# EAGLE design Video_Controller (EAGLE 9.7.0)
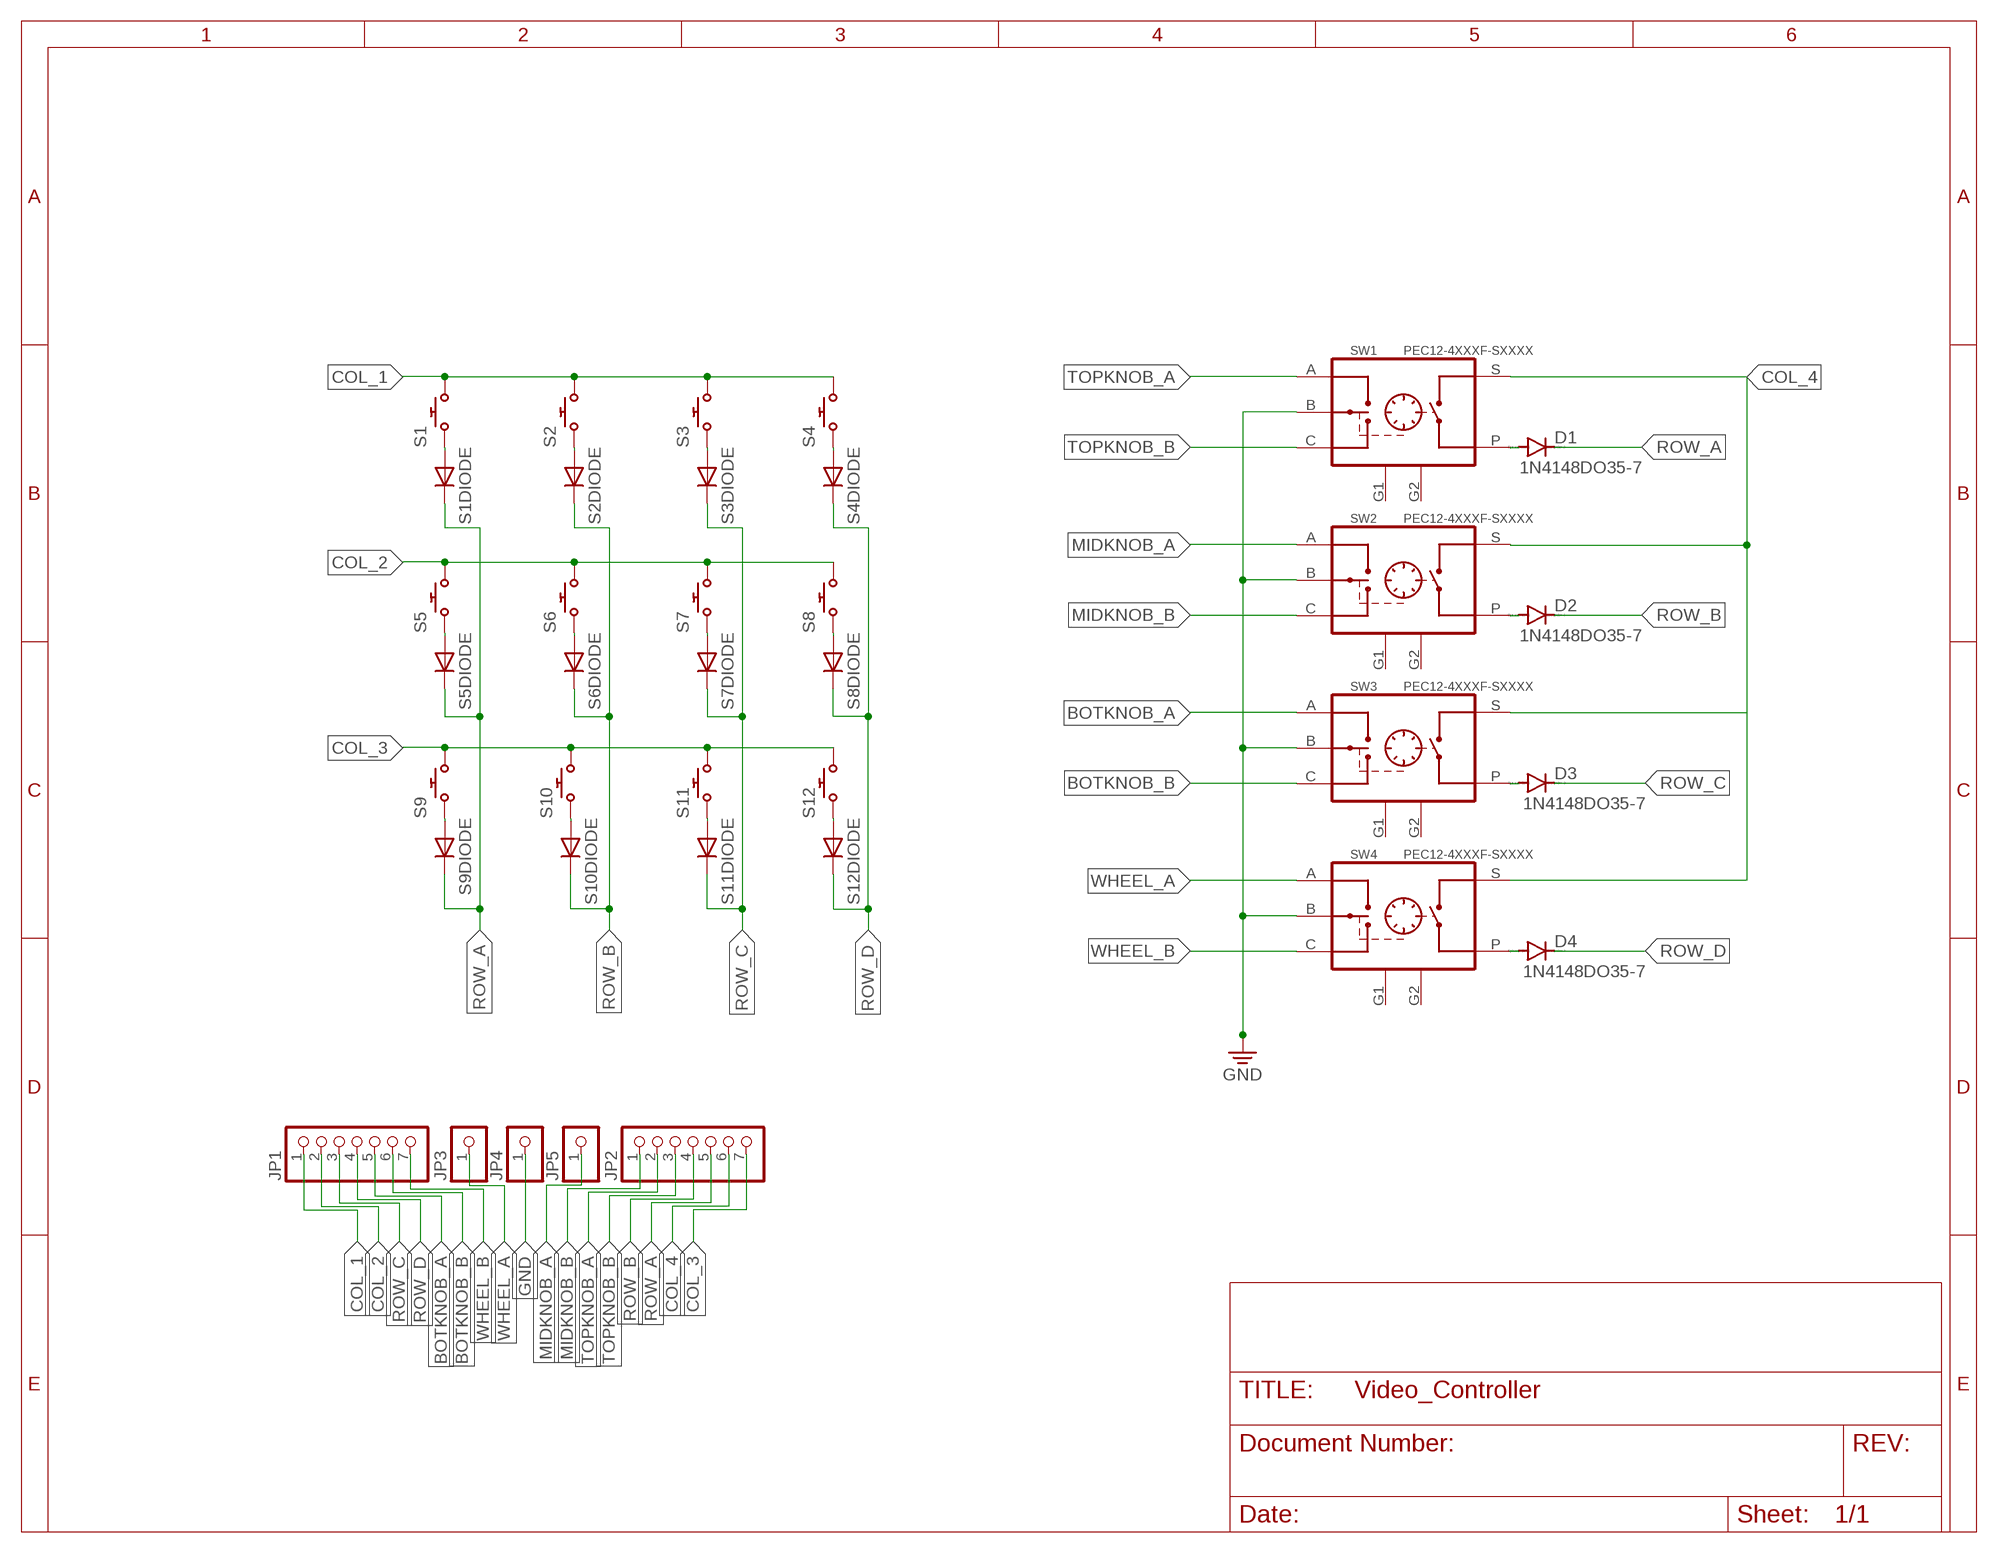
[diagram p0: schematic, sheet 1]

## Parts
D1  1N4148DO35-7  [DO35-7]
D2  1N4148DO35-7  [DO35-7]
D3  1N4148DO35-7  [DO35-7]
D4  1N4148DO35-7  [DO35-7]
JP1  PINHD-1X7  [1X07]
JP2  PINHD-1X7  [1X07]
JP3  PINHD-1X1  [1X01]
JP4  PINHD-1X1  [1X01]
JP5  PINHD-1X1  [1X01]
S1  CHERY_MX_DIODE  [CHERRY_MX_DIODE]
S2  CHERY_MX_DIODE  [CHERRY_MX_DIODE]
S3  CHERY_MX_DIODE  [CHERRY_MX_DIODE]
S4  CHERY_MX_DIODE  [CHERRY_MX_DIODE]
S5  CHERY_MX_DIODE  [CHERRY_MX_DIODE]
S6  CHERY_MX_DIODE  [CHERRY_MX_DIODE]
S7  CHERY_MX_DIODE  [CHERRY_MX_DIODE]
S8  CHERY_MX_DIODE  [CHERRY_MX_DIODE]
S9  CHERY_MX_DIODE  [CHERRY_MX_DIODE]
S10  CHERY_MX_DIODE  [CHERRY_MX_DIODE]
S11  CHERY_MX_DIODE  [CHERRY_MX_DIODE]
S12  CHERY_MX_DIODE  [CHERRY_MX_DIODE]
SW1  PEC12-4XXXF-SXXXX  [PEC12-4XXX]
SW2  PEC12-4XXXF-SXXXX  [PEC12-4XXX]
SW3  PEC12-4XXXF-SXXXX  [PEC12-4XXX]
SW4  PEC12-4XXXF-SXXXX  [PEC12-4XXX]

## Nets
BOTKNOB_A: JP1.5 SW3.A
BOTKNOB_B: JP1.6 SW3.C
COL_1: JP1.1 S1.S2 S2.S2 S3.S2 S4.S2
COL_2: JP1.2 S5.S2 S6.S2 S7.S2 S8.S2
COL_3: JP2.7 S9.S2 S10.S2 S11.S2 S12.S2
COL_4: JP2.6 SW1.S
GND: JP4.1 SW1.B SW2.B SW3.B SW4.B
MIDKNOB_A: JP5.1 SW2.A
MIDKNOB_B: JP2.1 SW2.C
N$1: S1.D1(A) S1.S1
N$2: S2.D1(A) S2.S1
N$3: S3.D1(A) S3.S1
N$4: S4.D1(A) S4.S1
N$5: D1.A SW1.P
N$6: D2.A SW2.P
N$7: D3.A SW3.P
N$8: D4.A SW4.P
N$9: S5.D1(A) S5.S1
N$10: S6.D1(A) S6.S1
N$11: S7.D1(A) S7.S1
N$12: S8.D1(A) S8.S1
N$13: S9.D1(A) S9.S1
N$15: S11.D1(A) S11.S1
N$16: S10.D1(A) S10.S1
N$17: SW2.S SW3.S SW4.S
N$18: S12.D1(A) S12.S1
ROW_A: D1.C JP2.5 S1.D2(C) S5.D2(C) S9.D2(C)
ROW_B: D2.C JP2.4 S2.D2(C) S6.D2(C) S10.D2(C)
ROW_C: D3.C JP1.3 S3.D2(C) S7.D2(C) S11.D2(C)
ROW_D: D4.C JP1.4 S4.D2(C) S8.D2(C) S12.D2(C)
TOPKNOB_A: JP2.2 SW1.A
TOPKNOB_B: JP2.3 SW1.C
WHEEL_A: JP3.1 SW4.A
WHEEL_B: JP1.7 SW4.C
Unconnected: SW1.G1 SW1.G2 SW2.G1 SW2.G2 SW3.G1 SW3.G2 SW4.G1 SW4.G2

## Library data of the parts
D1-D4 = diode:1N4148: DIODE high speed (Philips)
JP1 JP2 = pinhead:PINHD-1X7: PIN HEADER
JP3-JP5 = pinhead:PINHD-1X1: PIN HEADER
S1-S12 = cherry_tow:CHERY_MX_DIODE: Cherry MX with diode; FARNELL: 2292961; MOUSER: 540_MX1A_11NW
SW1-SW4 = buttons:PEC12-4XXXF-SXXXX: Rotary Encoder

## Net classes
0 default: width 0.813 mm, clearance 0.686 mm

## Board
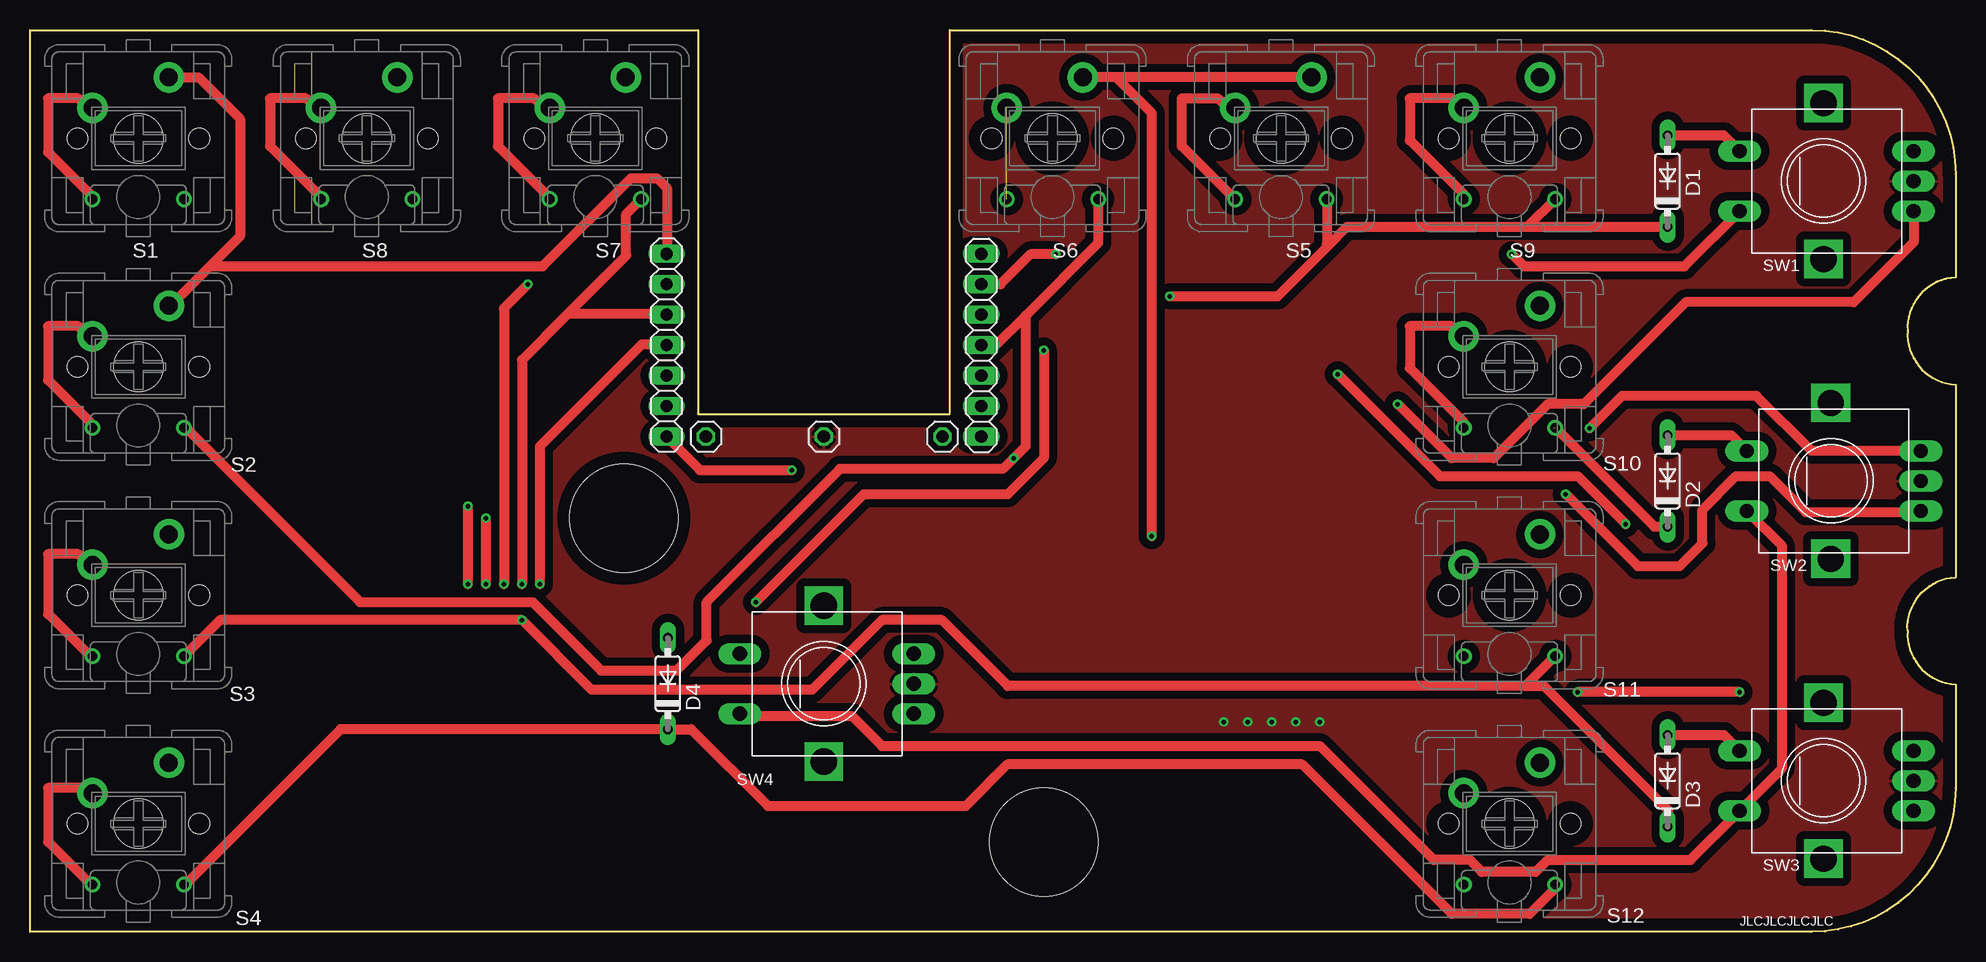
[diagram p1: board, top side]
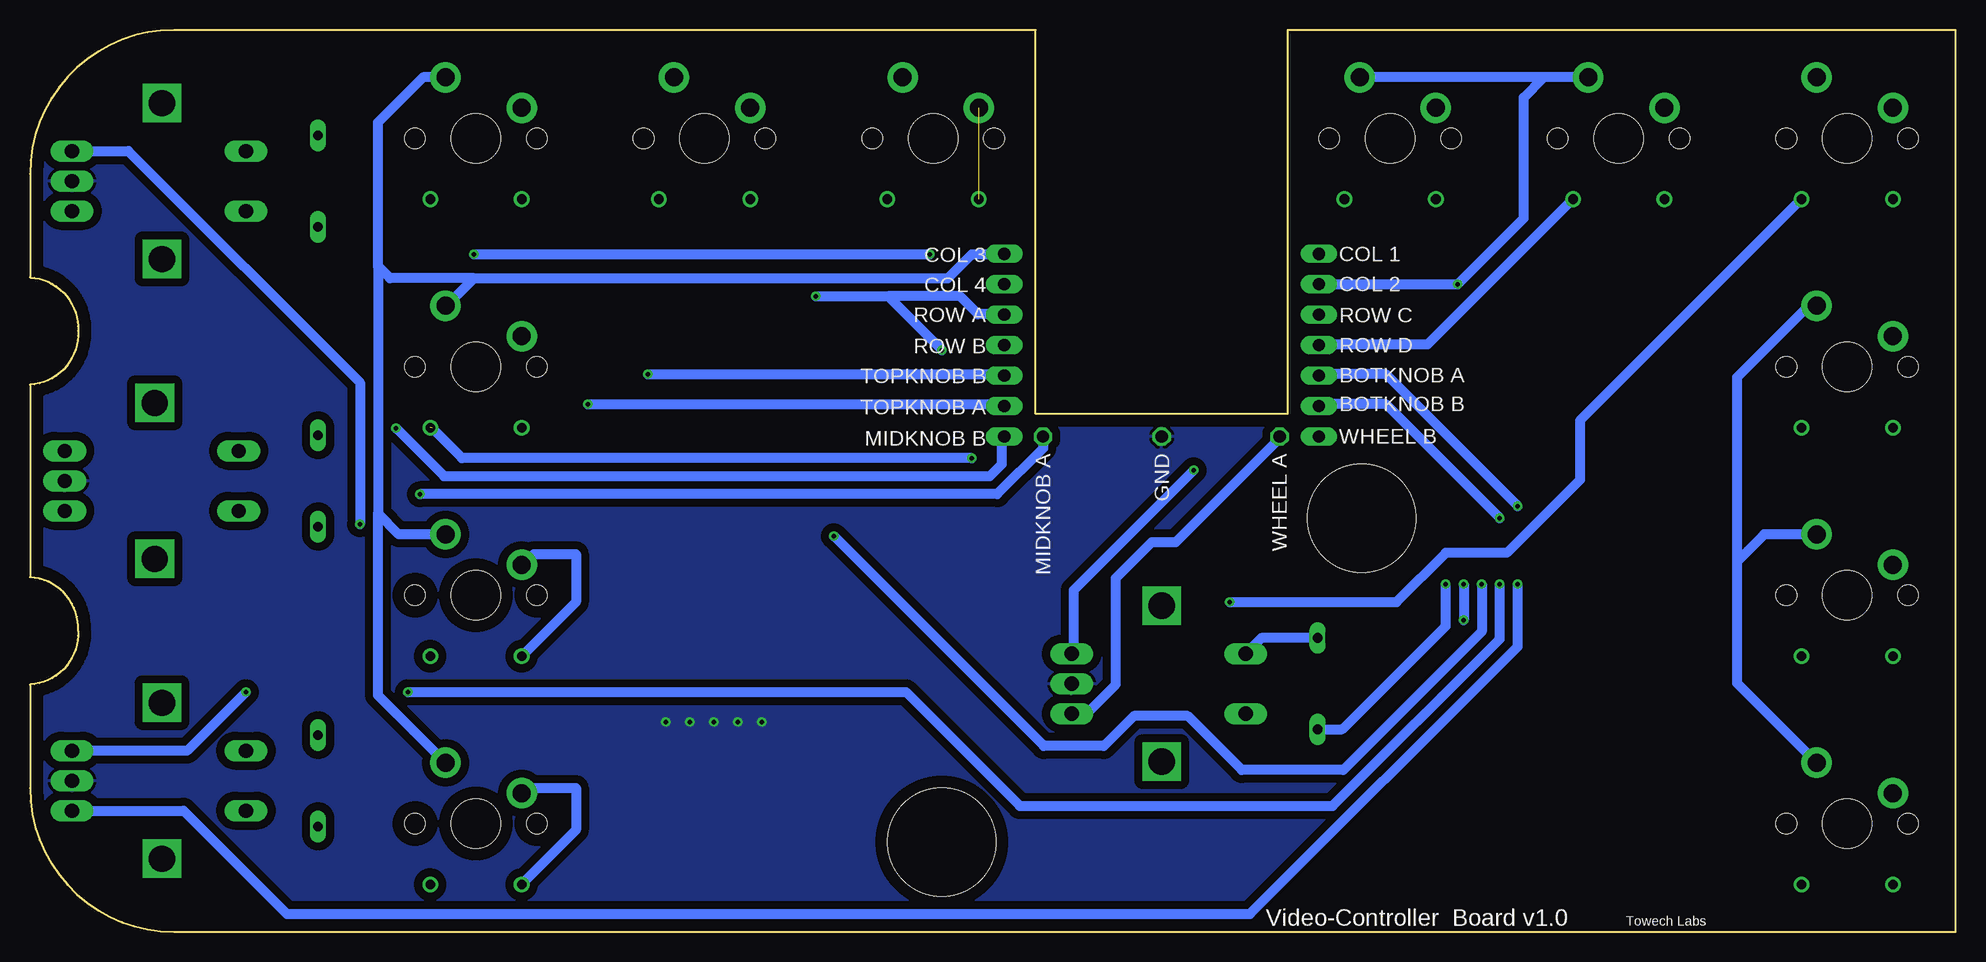
[diagram p2: board, bottom side, seen from below]

Size 160.5 x 75.2 mm. Coordinates in mm from the lower left corner, seen from the top.
Outline: 0,0 0,75.2 55.67,75.2 55.67,43.2 76.67,43.2 76.67,75.2 148.5,75.2 arc-90 160.5,63.2 160.5,54.57 arc90 156.5,50.1 arc90 160.5,45.63 160.5,29.57 arc90 156.5,25.1 arc90 160.5,20.63 160.5,12 arc-90 148.5,0 0,0
Copper layers (1*16): Top 0.035mm / dielectric 1.5mm / Bottom 0.035mm
Design rules "default *": minimum track width 6mil, minimum drill 0.35mm, track to track 6mil, track to pad 6mil, pad to pad 6mil, via to via 6mil, smd to smd 6mil, copper to edge 40mil, drill to drill 6mil, minimum pad ring 10mil, minimum via ring 8mil, stop-mask expansion 4mil, vias tented up to drill 0mil, thermal gap 10mil
Holes 9 mm at 49.5,34.5 84.5,7.5

### Footprints (pad centres in the part's own frame; a part is rotated, then mirrored left to right if it is on the bottom)
DO35-7 = drill 0.813 long: A 3.81,0; C -3.81,0
1X07 = drill 1.016 long: 1 -7.62,0; 2 -5.08,0; 3 -2.54,0; 4 0,0; 5 2.54,0; 6 5.08,0; 7 7.62,0
1X01 = drill 1.016 octagon: 1 0,0
CHERRY_MX_DIODE = drill 0.8: D1 -3.81,-5.08; D2 3.81,-5.08 | drill 1.5 pad 2.54: S1 -3.81,2.54; S2 2.54,5.08 | hole 1.7: -5.08,0; 5.08,0 | hole 4.1: 0,0
PEC12-4XXX = drill 1.2 long: A -2.5,-7.5; B 0,-7.5; C 2.5,-7.5; P 2.5,7; S -2.5,7 | drill 2.2 square: G1 -6.5,0; G2 6.5,0

### Placement (x,y rotation side)
D1  136.5,62.6 90 top
D2  136.5,37.6 90 top
D3  136.5,12.6 90 top
D4  53.17,20.7 90 top
JP1  53.05,48.92 270 top
JP2  79.29,48.92 90 top
JP3  56.34,41.3 0 top
JP4  66.17,41.3 0 top
JP5  76.06,41.3 0 top
S1  9.03,66.17 0 top
S2  9.03,47.12 0 top
S3  9.03,28.07 0 top
S4  9.03,9.03 0 top
S5  104.28,66.17 0 top
S6  85.22,66.17 0 top
S7  47.12,66.17 0 top
S8  28.07,66.17 0 top
S9  123.33,66.17 0 top
S10  123.33,47.12 0 top
S11  123.33,28.07 0 top
S12  123.33,9.03 0 top
SW1  149.5,62.6 90 top
SW2  150.11,37.6 90 top
SW3  149.5,12.6 90 top
SW4  66.17,20.7 90 top

### Tracks (layer width: path | path; a pad name or v marks a point on that pad's centre or on a via)
BOTKNOB_A  (via drill 0.35)
  Top 0.813: v36.5,29 v36.5,35.5
  Bottom 0.813: v36.5,35.5 47.5,46.5 53,46.5 JP1.5 | v36.5,29 36.5,23.8 58.8,1.5 128.5,1.5 139.1,1.5 147.7,10.1 SW3.A
BOTKNOB_B  (via drill 0.35)
  Top 0.813: v38,29 v38,34.5 | v142.5,20 v129,20
  Bottom 0.813: v38,34.5 47.5,44 53,44 JP1.6 | v129,20 87.5,20 78,10.5 51.92,10.5 38,24.42 v38,29 | v142.5,20 147.4,15.1 SW3.C
COL_1
  Top 0.813: 15,55.5 12,52.5 S2.S2 | 53,57 JP1.1 53.1,56.59 53.1,62 52.26,62.84 50.08,62.84 42.74,55.5 15,55.5 | S1.S2 14.04,71.25 17.5,67.8 17.5,58 15,55.5
  Bottom 0.813: S4.S2 18.2,20.74 18.2,30.9 | 18.2,30.9 18.2,46.24 12.24,52.2 S2.S2 | S3.S2 15.95,33.16 18.2,30.9
COL_2  (via drill 0.35)
  Top 0.813: v41.5,54 39.5,52 v39.5,29 | S5.S2 90.5,71.25 | 90.5,71.25 S6.S2 | v93.5,33 93.5,68.25 90.5,71.25
  Bottom 0.813: v93.5,33 76,15.5 71,15.5 68.5,18 64,18 59.5,13.5 51.04,13.5 39.5,25.04 v39.5,29 | JP1.2 v41.5,54 36,59.5 36,69.56 34.3,71.25 | S8.S2 34.3,71.25 | 34.3,71.25 S7.S2
COL_3
  Bottom 0.813: 123.5,54.5 121.7,54.5 84,54.5 82,56.5 79.5,56.5 JP2.7 | 123.5,54.5 125.5,52.5 S10.S2 | 131.5,55.5 131.5,67.5 127.75,71.25 S9.S2 | 131.5,55.5 131.5,34.9 | S12.S2 131.5,19.74 131.5,34.9 | S11.S2 129.75,33.16 131.5,34.9 | 123.5,54.5 130.5,54.5 131.5,55.5
COL_4  (via drill 0.35)
  Top 0.813: SW1.S 137.9,55.5 124.5,55.5 v123.5,56.5 | v85.5,56.5 83.4,56.5 80.9,54 JP2.6
  Bottom 0.813: v123.5,56.5 v85.5,56.5
GND  (via drill 0.35)
  other vias: 99.5,17.5 101.5,17.5 103.5,17.5 105.5,17.5 107.5,17.5
  pour Top: -3.9,-2.8 162,-2.8 162,76.5 -3.9,76.5
  pour Bottom: -3,-2 161.7,-2 161.7,75.6 -3,75.6
MIDKNOB_A  (via drill 0.35)
  Top 0.813: v128,36.5 134,30.5 137.5,30.5 139.4,32.4 139.4,35.2 142.2,38 145,38 148,35 157.5,35 SW2.A
  Bottom 0.813: v128,36.5 79.88,36.5 76.06,40.32 JP5.1
MIDKNOB_B  (via drill 0.35)
  Top 0.813: SW2.C 148.5,40.1 143.9,44.7 132.7,44.7 v130,42
  Bottom 0.813: JP2.1 79.5,41 79.5,39 80.5,38 126,38 v130,42
N$1
  Top 0.813: S1.D1 5,61.5 1.5,65 1.5,69.5 4,69.5 4.5,69 5,69 S1.S1
N$2
  Top 0.813: S2.D1 5,42.5 1.5,46 1.5,50.5 4,50.5 4.5,50 5,50 S2.S1
N$3
  Top 0.813: S3.D1 5,23 1.5,26.5 1.5,31.5 4,31.5 4.5,31 5,31 S3.S1
N$4
  Top 0.813: S4.D1 5,4 1.5,7.5 1.5,12 5,12 S4.S1
N$5
  Top 0.813: D1.A 141.19,66.41 SW1.P
N$6
  Top 0.813: D2.A 141.8,41.41 SW2.P
N$7
  Top 0.813: 136.5,16 D3.A 141.19,16.41 SW3.P
N$8
  Bottom 0.813: D4.A 57.86,24.51 SW4.P
N$9
  Top 0.813: S5.D1 100,61.5 96,65.5 96,69.5 99,69.5 99.5,69 100,69 S5.S1
N$10  (1 unrouted)
N$11
  Top 0.813: S7.D1 43,61.5 39,65.5 39,69.5 42,69.5 42.5,69 43,69 S7.S1
N$12
  Top 0.813: S8.D1 24,61.5 20,65.5 20,69.5 23,69.5 23.5,69 24,69 S8.S1
N$13
  Top 0.813: S9.D1 119.5,61.5 115,66 115,69.5 118.5,69.5 119,69 119.5,69 S9.S1
N$15
  Bottom 0.813: S11.D1 119.5,23 115,27.5 115,31.5 118.5,31.5 119,31 119.5,31 S11.S1
N$16
  Top 0.813: S10.D1 119.5,42.5 115,47 115,50.5 118.5,50.5 119,50 119.5,50 S10.S1
N$17
  Top 0.813: SW4.S 59.37,18 68.5,18 71,15.5 107.5,15.5 117,6 120,6 121,5 125.5,5 126.5,6 138.4,6 SW3.S 146,13.6 146,32.21 SW2.S
N$18
  Bottom 0.813: S12.D1 119.5,4 115,8.5 115,12 119.5,12 S12.S1
ROW_A  (via drill 0.35)
  Top 0.813: 127,61 S9.D2 124.83,58.79 | v84.5,48.5 84.5,39.5 81.5,36.5 69.5,36.5 v60.5,27.5 | v95,53 104,53 108.2,57.2 | 108.2,57.2 109.79,58.79 124.83,58.79 | 124.83,58.79 D1.C | S5.D2 108.08,57.31 108.2,57.2
  Bottom 0.813: v60.5,27.5 46.6,27.5 42.5,31.6 37.4,31.6 31.3,37.7 31.3,42.63 S1.D2 13,61 | JP2.5 79.5,51.5 81.5,51.5 83,53 89,53 | v95,53 89,53 | 89,53 v84.5,48.5
ROW_B  (via drill 0.35)  (1 unrouted)
  Top 0.813: S2.D2 13,42 27.5,27.5 41.9,27.5 47.6,21.8 53.9,21.8 56.4,24.3 56.4,27.5 67.5,38.6 81.1,38.6 v82,39.5 83,40.5 83,51.4 | 89,61 S6.D2 89.03,57.44 83,51.4 | S10.D2 135.39,33.79 D2.C | JP2.4 80.52,48.92 83,51.4
  Bottom 0.813: 127,42 124.5,39.5 v82,39.5
ROW_C  (via drill 0.35)
  Top 0.813: JP1.3 53,51.5 44.8,51.5 | 44.8,51.5 41,47.7 v41,29 | 44.8,51.5 49.7,56.4 49.7,59.86 S7.D2 | S3.D2 15.84,26 v41,26 46.8,20.2 65.2,20.2 71,26 76,26 81.5,20.5 124.64,20.5 | 124.64,20.5 S11.D2 | 124.64,20.5 126.2,20.5 136.5,10.2 D3.C
  Bottom 0.813: v41,29 v41,26
ROW_D  (via drill 0.35)
  Top 0.813: S4.D2 13,4 25.89,16.89 D4.C 55.11,16.89 61.5,10.5 78,10.5 81.45,13.95 106.05,13.95 118.5,1.5 125,1.5 127,3.5 S12.D2 | v42.5,29 42.5,40.5 51,49 53,49 JP1.4
  Bottom 0.813: S8.D2 32,61 44,49 53,49 JP1.4 | v42.5,29 42.5,25.5 51.11,16.89 D4.C
TOPKNOB_A  (via drill 0.35)
  Top 0.813: SW1.A 157,57.5 152,52.5 138,52.5 129.5,44 126.5,44 122,39.5 118.5,39.5 v114,44
  Bottom 0.813: v114,44 79.5,44 JP2.2
TOPKNOB_B  (via drill 0.35)
  Top 0.813: v109,46.5 117.5,38 129,38 v133,34
  Bottom 0.813: v109,46.5 79.5,46.5 JP2.3 | SW1.C 152.3,65.1 133,45.8 v133,34
WHEEL_A
  Bottom 0.813: JP3.1 56.5,41 65,32.5 67,32.5 70,29.5 70,20.65 72.45,18.2 SW4.A
WHEEL_B  (via drill 0.35)
  Top 0.813: JP1.7 55.85,38.5 v63.5,38.5
  Bottom 0.813: v63.5,38.5 73.5,28.5 73.5,23.5 SW4.C

### Text on the board
tNames: JLCJLCJLCJLC
bNames: COL 3 | COL 1 | COL 4 | COL 2 | ROW A | ROW C | ROW B | ROW D | TOPKNOB B | BOTKNOB A | TOPKNOB A | BOTKNOB B | MIDKNOB B | WHEEL B | WHEEL A | GND | MIDKNOB A | Towech Labs | Video-Controller Board v1.0